# EAGLE design firefly2_auto_thruhole (EAGLE 5.12)
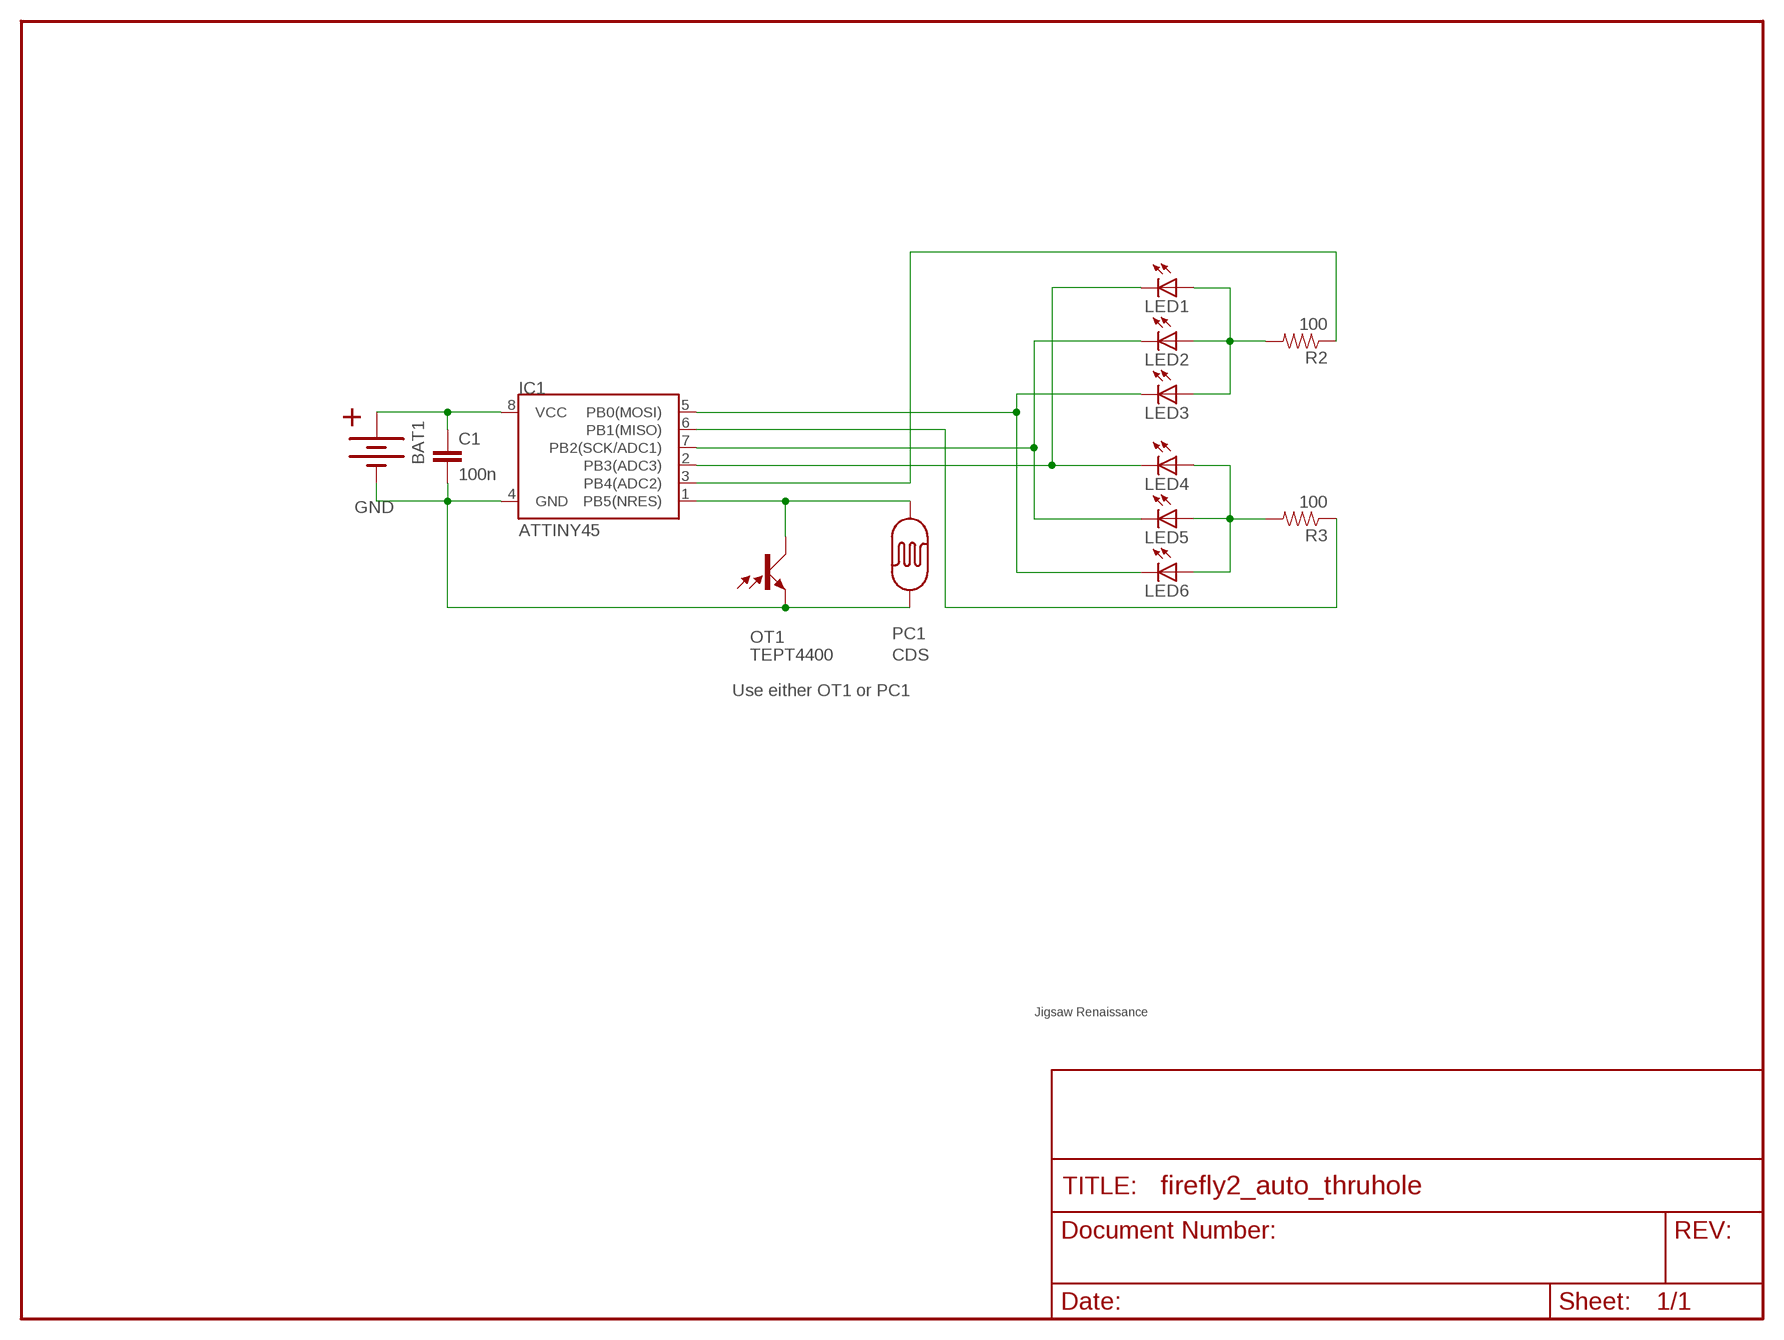
[diagram p0: schematic, sheet 1]

## Parts
BAT1  FIREFLY_BATTERY20PTH  [FIREFLY_BATTCOM_20MM_PTH]
C1  100n  CAPPTH-5MM  [CAP-PTH-5MM]
IC1  ATTINY45  FIREFLY_ATTINY45DIP08  [FIREFLY_DIP08]
LED1  FIREFLY_LED3MM  [FIREFLY_LED3MM]
LED2  FIREFLY_LED3MM  [FIREFLY_LED3MM]
LED3  FIREFLY_LED3MM  [FIREFLY_LED3MM]
LED4  FIREFLY_LED3MM  [FIREFLY_LED3MM]
LED5  FIREFLY_LED3MM  [FIREFLY_LED3MM]
LED6  FIREFLY_LED3MM  [FIREFLY_LED3MM]
OT1  TEPT4400  [FIREFLY_LED3MM]
PC1  CDS  FIREFLY_PHOTOCELLPTH  [FIREFLY_PHOTOCELL]
R2  100  FIREFLY_RESISTORPTH1  [FIREFLY_AXIAL-0.3]
R3  100  FIREFLY_RESISTORPTH1  [FIREFLY_AXIAL-0.3]
U$1  JIGSAW_LOGO  [JIGSAWLOGO]

## Nets
GND: BAT1.2(-) C1.2 IC1.4(GND) OT1.K(E) PC1.1
N$1: IC1.1(PB5(NRES)) OT1.A(C) PC1.2
N$4: IC1.6(PB1(MISO)) R3.P$1
N$5: LED1.A LED2.A LED3.A R2.P$2
N$6: LED4.A LED5.A LED6.A R3.P$2
N$7: IC1.2(PB3(ADC3)) LED1.K(C) LED4.K(C)
N$8: IC1.7(PB2(SCK/ADC1)) LED2.K(C) LED5.K(C)
N$9: IC1.5(PB0(MOSI)) LED3.K(C) LED6.K(C)
N$10: IC1.3(PB4(ADC2)) R2.P$1
VBATT: BAT1.1(+) C1.1 IC1.8(VCC)

## Notes on the sheet
- +
- Use either OT1 or PC1

## Library data of the parts
BAT1 = firefly2_auto_thruhole:FIREFLY_BATTERY: Battery Holders Various common sizes : AA, AAA, 20mm coin cell and 12mm coin cell.
C1 = firefly:CAP: Capacitor Standard 0603 ceramic capacitor, and 0.1" leaded capacitor.
IC1 = firefly2_auto_thruhole:FIREFLY_ATTINY45: Atmel ATTiny45
LED1-LED6 = firefly2_auto_thruhole:FIREFLY_LED: LEDs Standard schematic elements and footprints for 5mm, 3mm, 1206, and 0603 sized LEDs. 5mm - Spark Fun Electronics SKU : COM-00529 (and others)
OT1 = firefly2_auto_thruhole:TEPT4400
PC1 = firefly2_auto_thruhole:FIREFLY_PHOTOCELL
R2 R3 = firefly2_auto_thruhole:FIREFLY_RESISTOR: Resistor Basic schematic elements and footprints for 0603, 1206, and PTH 1/10th watt (small) resistors.
U$1 = firefly2_auto_thruhole:JIGSAW_LOGO

## Board
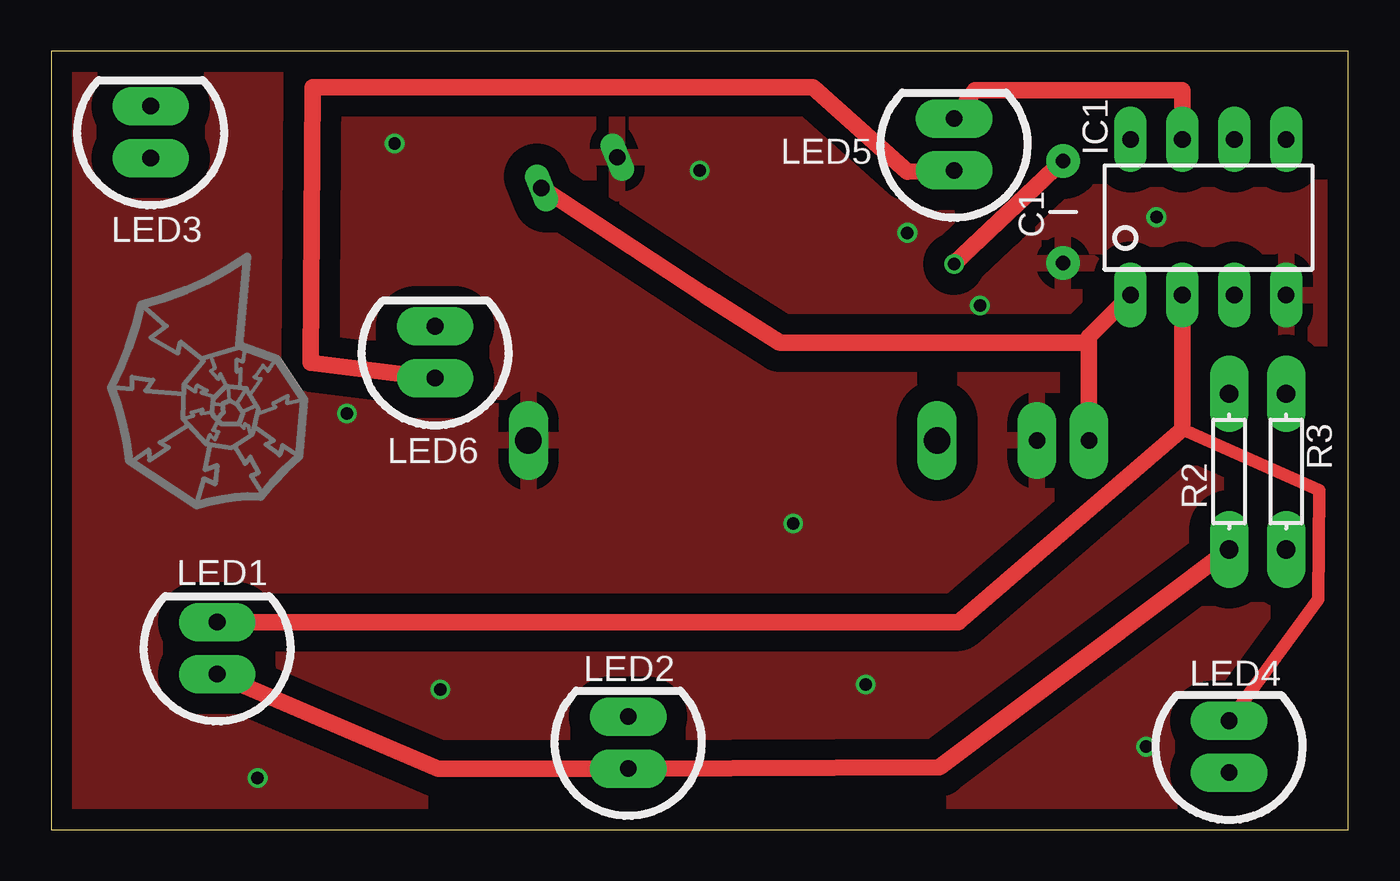
[diagram p1: board, top side]
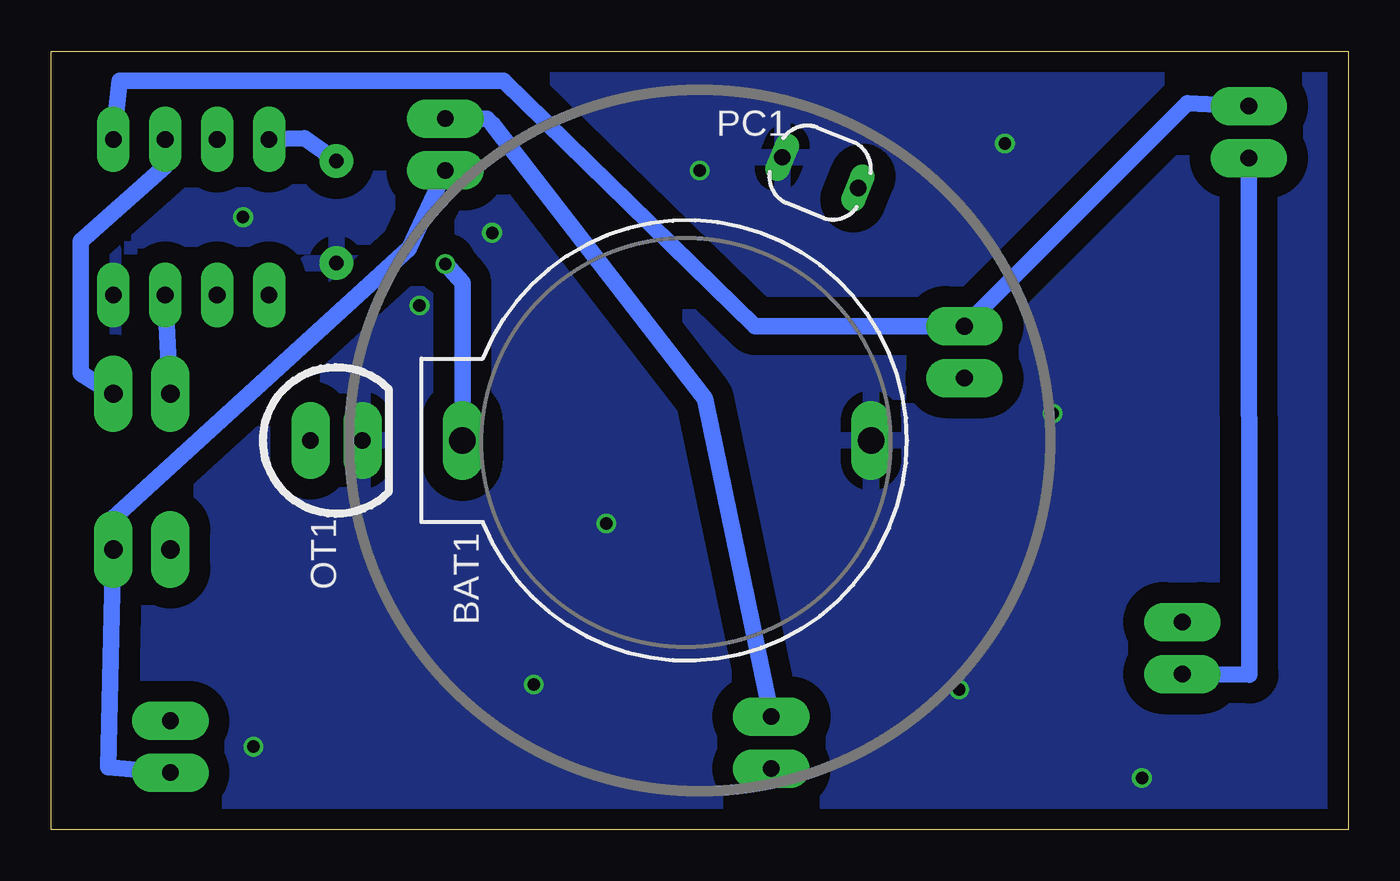
[diagram p2: board, bottom side, seen from below]

Size 63.5 x 38.1 mm. Coordinates in mm from the lower left corner, seen from the top.
Outline: 0,0 63.5,0 63.5,38.1 0,38.1 0,0
Copper layers (1*16): Top 0.0178mm / dielectric 0.8128mm / Bottom 0.0178mm
Design rules "GoldPhoenix *": minimum track width 7mil, minimum drill 15mil, track to track 7mil, track to pad 7mil, pad to pad 7mil, via to via 7mil, smd to smd 6mil, copper to edge 40mil, drill to drill 40mil, minimum pad ring 7mil, minimum via ring 7mil, stop-mask expansion 4mil, vias tented up to drill 0mil, thermal gap 20mil
tKeepout: area 21,7.5 to 43.8,30.4

### Footprints (pad centres in the part's own frame; a part is rotated, then mirrored left to right if it is on the bottom)
FIREFLY_BATTCOM_20MM_PTH = drill 1.295 long: 1 20,0; 2 0,0
CAP-PTH-5MM = drill 0.7 pad 1.651 round: 1 -2.5,0; 2 2.5,0
FIREFLY_DIP08 = drill 0.813 pad 1.6 long: 1 -3.81,-3.81; 2 -1.27,-3.81; 3 1.27,-3.81; 4 3.81,-3.81; 5 3.81,3.81; 6 1.27,3.81; 7 -1.27,3.81; 8 -3.81,3.81
FIREFLY_LED3MM = drill 0.813 pad 1.88 long: A -1.27,0; K 1.27,0
FIREFLY_PHOTOCELL = drill 0.8 long: 1 -2,0; 2 2,0
FIREFLY_AXIAL-0.3 = drill 0.9 pad 1.88 long: P$1 -3.81,0; P$2 3.81,0

### Placement (x,y rotation side)
BAT1  23.37,19.05 180 bottom
C1  49.53,30.23 270 top
IC1  56.64,29.97 0 top
LED1  8.13,8.89 90 top
LED2  28.24,4.27 90 top
LED3  4.88,34.14 90 top
LED4  57.66,4.06 90 top
LED5  44.2,33.53 90 top
LED6  18.8,23.37 90 top
OT1  49.53,19.05 0 bottom
PC1  25.86,32.16 338 bottom
R2  57.66,17.53 270 top
R3  60.45,17.53 270 top
U$1  8.64,20.47 0 top

### Tracks (layer width: path | path; a pad name or v marks a point on that pad's centre or on a via)
GND  (via drill 0.61 pad 0.66)
  other vias: 16.81,33.58 31.75,32.26 41.91,29.21 10.11,2.54 45.47,25.65 14.48,20.37 39.88,7.11 19.05,6.86 36.32,14.99 54.1,29.97 53.59,4.06
  pour Top (isolate 1.016): 0,39.12 64.26,39.12 64.26,0 0,0
  pour Bottom (isolate 1.016): 0,39.12 64.26,39.12 64.26,0 0,0
N$1
  Top 0.813: PC1.2 32,26.16 35.69,23.82 50.8,23.82 | 50.8,23.82 50.8,24.13 IC1.1 | 50.8,23.82 OT1.A
N$4
  Bottom 0.813: IC1.6 57.91,32.47 62.05,28.79 62.05,22.33 R3.P$1
N$5
  Top 0.813: LED1.A 18.95,3 LED2.A 43.48,3.05 R2.P$2
  Bottom 0.813: LED1.A 4.85,7.59 LED3.A
N$6
  Top 0.813: LED5.A 41.91,32.21 37.29,36.32 12.8,36.32 12.7,22.86 LED6.A
  Bottom 0.813: LED5.A 45.97,28.45 60.2,15.49 60.45,15.24 R3.P$2 60.71,3.05 LED4.A
N$7
  Top 0.61: LED4.K 62.02,11.28 62.08,16.61 55.37,19.6
  Top 0.813: IC1.2 55.37,19.6 44.41,10.16 LED1.K
N$8
  Top 0.813: LED5.K 45.21,36.2 55.37,36.2 IC1.7
  Bottom 0.813: LED2.K 31.5,21.08 41.91,34.54 42.16,34.8 LED5.K
N$9
  Bottom 0.813: IC1.5 60.13,36.64 41.36,36.64 29.05,24.64 LED6.K 7.87,35.56 LED3.K
N$10
  Bottom 0.813: R2.P$1 IC1.3
VBATT  (via drill 0.61 pad 0.66)
  Top 0.813: C1.1 46.4,29.76 v44.2,27.69
  Bottom 0.813: v44.2,27.69 43.37,26.76 BAT1.1 | IC1.8 51.08,33.83 C1.1

### Text on the board
tDocu: Fireflies | Jigsaw Renaissance